# EAGLE design BusBlaster-v2.5 (EAGLE 5.07)
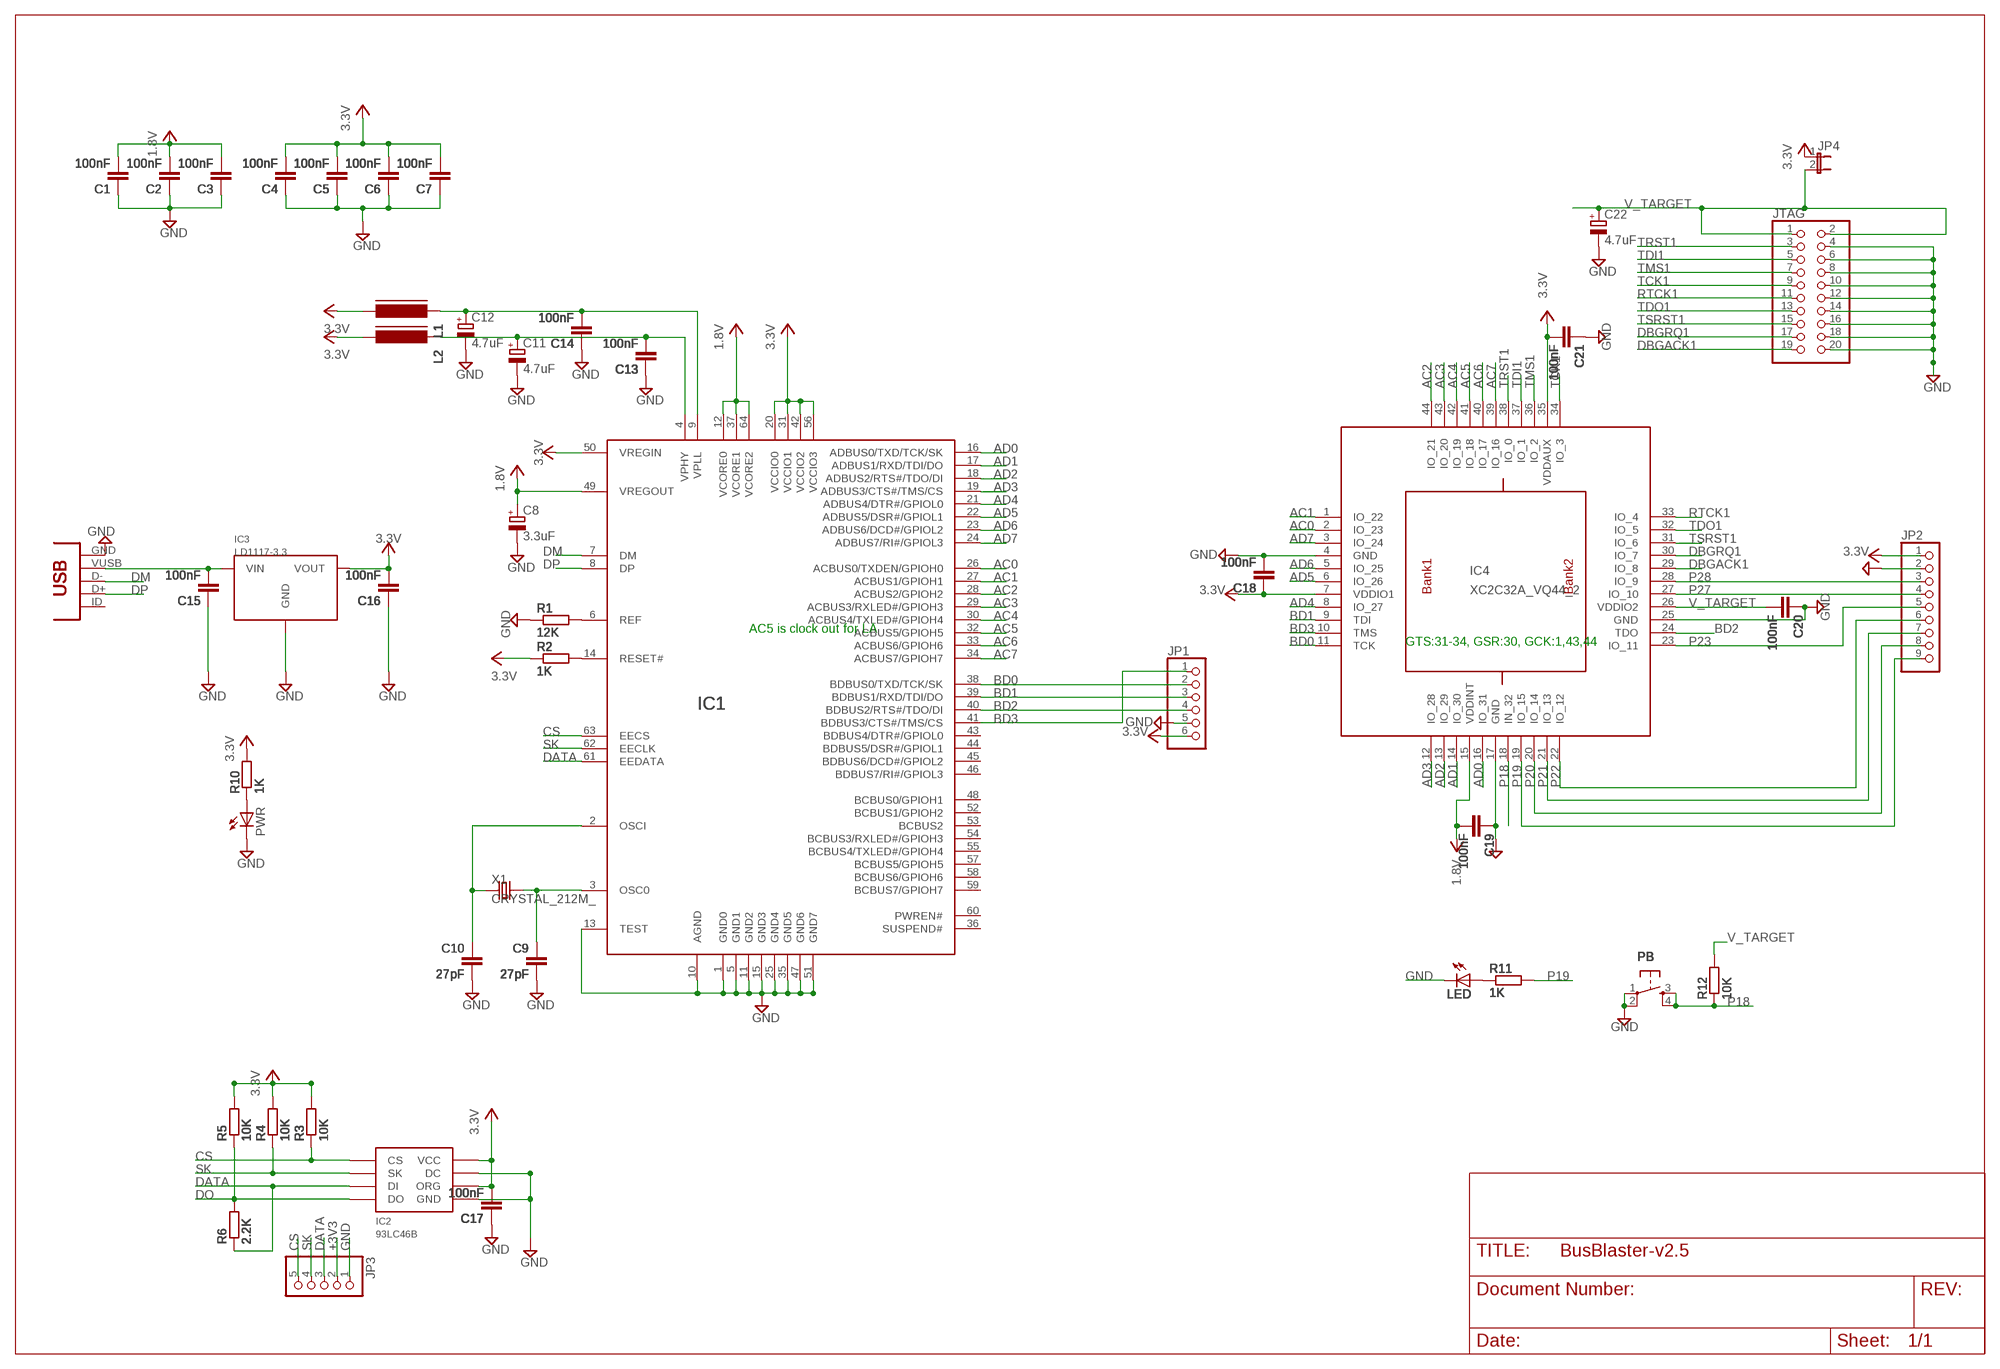
[diagram p0: schematic, sheet 1]

## Parts
C1  100nF  CAPC603  [C603]
C2  100nF  CAPC603  [C603]
C3  100nF  CAPC603  [C603]
C4  100nF  CAPC603  [C603]
C5  100nF  CAPC603  [C603]
C6  100nF  CAPC603  [C603]
C7  100nF  CAPC603  [C603]
C8  3.3uF  CAP_POLSMC_A  [SMC_A]
C9  27pF  CAPC603  [C603]
C10  27pF  CAPC603  [C603]
C11  4.7uF  CAP_POLSMC_A  [SMC_A]
C12  4.7uF  CAP_POLSMC_A  [SMC_A]
C13  100nF  CAPC603  [C603]
C14  100nF  CAPC603  [C603]
C15  100nF  CAPC603  [C603]
C16  100nF  CAPC603  [C603]
C17  100nF  CAPC603  [C603]
C18  100nF  CAPC603  [C603]
C19  100nF  CAPC603  [C603]
C20  100nF  CAPC603  [C603]
C21  100nF  CAPC603  [C603]
C22  4.7uF  CAP_POLSMC_A  [SMC_A]
IC1  FT2232H  [LQFP64]
IC2  93LC46B  93C46  [SOIC8]
IC3  LD1117-3.3  [SOT223]
IC4  XC2C32A_VQ44_2  [VQ44]
JP1  PINHD-1X6  [1X06]
JP2  PINHD-1X9  [1X09]
JP3  PINHD-1X5  [1X05]
JP4  JP1EJP  [1X02]
JTAG  PINHEAD_-_COPY_PINHD-2X10SHROUDED  [PINHEAD_-_COPY_PINSHRD_PTH_2X10]
L1  FERRITE_BEAD603  [FB603]
L2  FERRITE_BEAD603  [FB603]
LED  LED805  [LED-805]
PB  SW-SMD-SMALL  [TACT_SWITCH_SMALL]
PWR  LEDCHIPLED_0805  [CHIPLED_0805]
R1  12K  RESISTORR603  [R603]
R2  1K  RESISTORR603  [R603]
R3  10K  RESISTORR603  [R603]
R4  10K  RESISTORR603  [R603]
R5  10K  RESISTORR603  [R603]
R6  2.2K  RESISTORR603  [R603]
R10  1K  RESISTORR603  [R603]
R11  1K  RESISTORR603  [R603]
R12  10K  RESISTORR603  [R603]
USB  CON-USB-MINI-BUSB1  [CONN_USB_MINI-B]
X1  CRYSTAL_212M_  [4X6]

## Nets
1.8V: C1.2 C2.2 C3.2 C8.+ C19.2 IC1.12(VCORE0) IC1.37(VCORE1) IC1.49(VREGOUT) IC1.64(VCORE2) IC4.15(VDDINT)
+3V3: C4.2 C5.2 C6.2 C7.2 C16.2 C17.2 C18.1 C21.2 IC1.20(VCCIO0) IC1.31(VCCIO1) IC1.42(VCCIO2) IC1.50(VREGIN) IC1.56(VCCIO3) IC2.6(ORG) IC2.8(VCC) IC3.2(VOUT) IC4.7(VDDIO1) IC4.35(VDDAUX) JP1.6 JP2.1 JP3.2 JP4.1 L1.2 L2.2 R2.1 R3.2 R4.2 R5.2 R10.2 ; supply symbol labelled 3.3V
AC0: IC1.26(ACBUS0/TXDEN/GPIOH0) IC4.2(IO_23)
AC1: IC1.27(ACBUS1/GPIOH1) IC4.1(IO_22)
AC2: IC1.28(ACBUS2/GPIOH2) IC4.44(IO_21)
AC3: IC1.29(ACBUS3/RXLED#/GPIOH3) IC4.43(IO_20)
AC4: IC1.30(ACBUS4/TXLED#/GPIOH4) IC4.42(IO_19)
AC5: IC1.32(ACBUS5/GPIOH5) IC4.41(IO_18)
AC6: IC1.33(ACBUS6/GPIOH6) IC4.40(IO_17)
AC7: IC1.34(ACBUS7/GPIOH7) IC4.39(IO_16)
AD0: IC1.16(ADBUS0/TXD/TCK/SK) IC4.16(IO_31)
AD1: IC1.17(ADBUS1/RXD/TDI/DO) IC4.14(IO_30)
AD2: IC1.18(ADBUS2/RTS#/TDO/DI) IC4.13(IO_29)
AD3: IC1.19(ADBUS3/CTS#/TMS/CS) IC4.12(IO_28)
AD4: IC1.21(ADBUS4/DTR#/GPIOL0) IC4.8(IO_27)
AD5: IC1.22(ADBUS5/DSR#/GPIOL1) IC4.6(IO_26)
AD6: IC1.23(ADBUS6/DCD#/GPIOL2) IC4.5(IO_25)
AD7: IC1.24(ADBUS7/RI#/GPIOL3) IC4.3(IO_24)
BD0: IC1.38(BDBUS0/TXD/TCK/SK) IC4.11(TCK) JP1.2
BD1: IC1.39(BDBUS1/RXD/TDI/DO) IC4.9(TDI) JP1.3
BD2: IC1.40(BDBUS2/RTS#/TDO/DI) IC4.24(TDO) JP1.4
BD3: IC1.41(BDBUS3/CTS#/TMS/CS) IC4.10(TMS) JP1.1
CS: IC1.63(EECS) IC2.1(CS) JP3.5 R3.1
DATA: IC1.61(EEDATA) IC2.3(DI) JP3.3 R6.1
DBGACK1: IC4.29(IO_8) JTAG.19
DBGRQ1: IC4.30(IO_7) JTAG.17
DM: IC1.7(DM) USB.D-
DO: IC2.4(DO) R5.1 R6.2
DP: IC1.8(DP) USB.D+
GND: C1.1 C2.1 C3.1 C4.1 C5.1 C6.1 C7.1 C8.- C9.2 C10.2 C11.- C12.- C13.1 C14.1 C15.1 C16.1 C17.1 C18.2 C19.1 C20.1 C21.1 C22.- IC1.1(GND0) IC1.5(GND1) IC1.10(AGND) IC1.11(GND2) IC1.13(TEST) IC1.15(GND3) IC1.25(GND4) IC1.35(GND5) IC1.47(GND6) IC1.51(GND7) IC2.5(GND) IC2.7(DC) IC3.1(GND) IC4.4(GND) IC4.17(GND) IC4.25(GND) JP1.5 JP2.2 JP3.1 JTAG.4 JTAG.6 JTAG.8 JTAG.10 JTAG.12 JTAG.14 JTAG.16 JTAG.18 JTAG.20 LED.C PB.1 PB.2 PWR.C R1.1 USB.GND
N$1: C9.1 IC1.3(OSC0) X1.2(X2)
N$2: C10.1 IC1.2(OSCI) X1.1(X1)
N$3: IC1.14(RESET#) R2.2
N$4: IC1.6(REF) R1.2
N$5: C15.2 IC3.3(VIN) USB.VUSB
N$6: PWR.A R10.1
N$8: LED.A R11.1
P18: IC4.18(IN_32) PB.3 PB.4 R12.1
P19: IC4.19(IO_15) JP2.9 R11.2
P20: IC4.20(IO_14) JP2.8
P21: IC4.21(IO_13) JP2.7
P22: IC4.22(IO_12) JP2.6
P23: IC4.23(IO_11) JP2.5
P27: IC4.27(IO_10) JP2.4
P28: IC4.28(IO_9) JP2.3
RTCK1: IC4.33(IO_4) JTAG.11
SK: IC1.62(EECLK) IC2.2(SK) JP3.4 R4.1
TCK1: IC4.34(IO_3) JTAG.9
TDI1: IC4.37(IO_1) JTAG.5
TDO1: IC4.32(IO_5) JTAG.13
TMS1: IC4.36(IO_2) JTAG.7
TRST1: IC4.38(IO_0) JTAG.3
TSRST1: IC4.31(IO_6) JTAG.15
V_TARGET: C20.2 C22.+ IC4.26(VDDIO2) JP4.2 JTAG.1 JTAG.2 R12.2
VPHY: C11.+ C13.2 IC1.4(VPHY) L2.1
VPLL: C12.+ C14.2 IC1.9(VPLL) L1.1
Unconnected: IC1.36(SUSPEND#) IC1.43(BDBUS4/DTR#/GPIOL0) IC1.44(BDBUS5/DSR#/GPIOL1) IC1.45(BDBUS6/DCD#/GPIOL2) IC1.46(BDBUS7/RI#/GPIOL3) IC1.48(BCBUS0/GPIOH1) IC1.52(BCBUS1/GPIOH2) IC1.53(BCBUS2) IC1.54(BCBUS3/RXLED#/GPIOH3) IC1.55(BCBUS4/TXLED#/GPIOH4) IC1.57(BCBUS5/GPIOH5) IC1.58(BCBUS6/GPIOH6) IC1.59(BCBUS7/GPIOH7) IC1.60(PWREN#) USB.BODY@1(BODY) USB.BODY@2(BODY) USB.BODY@3(BODY) USB.BODY@4(BODY) USB.ID(USBID)

## Notes on the sheet
- AC5 is clock out for LA
- GTS:31-34, GSR:30, GCK:1,43,44

## Library data of the parts
C1-C7 C9 C10 C13-C21 = dp_devices:CAP
C8 C11 C12 C22 = DP-EagleLibrary:CAP_POL
IC1 = dp_devices:FT2232H: DUAL HIGH SPEED USB TO MULTIPURPOSE UART/FIFO IC
IC2 = DP-EagleLibrary:93C46
IC3 = DP-EagleLibrary:LD1117-3.3
IC4 = dp_devices:XC2C32A_VQ44_2: xc2c32a_vq44-ian edit this description Auto generated by make-symbol-device-package-bsdl.ulp Rev. 29 Source: xc2c32a_vq44-ian.bsd
JP1 = pinhead:PINHD-1X6: PIN HEADER
JP2 = pinhead - Copy:PINHD-1X9: PIN HEADER
JP3 = pinhead:PINHD-1X5: PIN HEADER
JP4 = jumper:JP1E: JUMPER
JTAG = LPC1768board:PINHEAD_-_COPY_PINHD-2X10: PIN HEADER
L1 L2 = dp_devices:FERRITE_BEAD
LED = dp_devices:LED
PB = dp_devices:SW-SMD-SMALL
PWR = led:LED: LED OSRAM: - CHIPLED LG R971, LG N971, LY N971, LG Q971, LY Q971, LO R971, LY R971 LH N974, LH R974 LS Q976, LO Q976, LY Q976 LO Q996 - Hyper CHIPLED LW Q18S LB Q993, LB Q99A, LB R99A - SideLED LS A670, LO A670, LY A670, LG A670, LP A670 LB A673, LV A673, LT A673, LW A673 LH A674 LY A675 LS A676, LA A676, LO A676, LY A676, LW A676 LS A679, LY A679, LG A679 - Hyper Micro SIDELED® LS Y876, LA Y876, LO Y876, LY Y876 LT Y87S - SmartLED LW L88C, LW L88S LB L89C, LB L89S, LG L890 LS L89K, LO L89K, LY L89K LS L896, LA L896, LO L896, LY L896 - TOPLED LS T670, LO T670, LY T670, LG T670, LP T670 LSG T670, LSP T670, LSY T670, LOP T670, LYG T670 LG T671, LOG T671, LSG T671 LB T673, LV T673, LT T673, LW T673 LH T674 LS T676, LA T676, LO T676, LY T676, LB T676, LH T676, LSB T676, LW T676 LB T67C, LV T67C, LT T67C, LS T67K, LO T67K, LY T67K, LW E67C LS E67B, LA E67B, LO E67B, LY E67B, LB E67C, LV E67C, LT E67C LW T67C LS T679, LY T679, LG T679 LS T770, LO T770, LY T770, LG T770, LP T770 LB T773, LV T773, LT T773, LW T773 LH T774 LS E675, LA E675, LY E675, LS T675 LS T776, LA T776, LO T776, LY T776, LB T776 LHGB T686 LT T68C, LB T68C - Hyper Mini TOPLED® LB M676 - Mini TOPLED Santana® LG M470 LS M47K, LO M47K, LY M47K Source: http://www.osram.convergy.de LUXEON: - LUMILED® LXK2-PW12-R00, LXK2-PW12-S00, LXK2-PW14-U00, LXK2-PW14-V00 LXK2-PM12-R00, LXK2-PM12-S00, LXK2-PM14-U00 LXK2-PE12-Q00, LXK2-PE12-R00, LXK2-PE12-S00, LXK2-PE14-T00, LXK2-PE14-U00 LXK2-PB12-K00, LXK2-PB12-L00, LXK2-PB12-M00, LXK2-PB14-N00, LXK2-PB14-P00, LXK2-PB14-Q00 LXK2-PR12-L00, LXK2-PR12-M00, LXK2-PR14-Q00, LXK2-PR14-R00 LXK2-PD12-Q00, LXK2-PD12-R00, LXK2-PD12-S00 LXK2-PH12-R00, LXK2-PH12-S00 LXK2-PL12-P00, LXK2-PL12-Q00, LXK2-PL12-R00 Source: www.luxeon.com KINGBRIGHT: KA-3528ASYC Source: www.kingbright.com
R1-R6 R10-R12 = dp_devices:RESISTOR
USB = dp_devices:CON-USB-MINI-B: USB connector
X1 = dp_devices:CRYSTAL_2

## Board
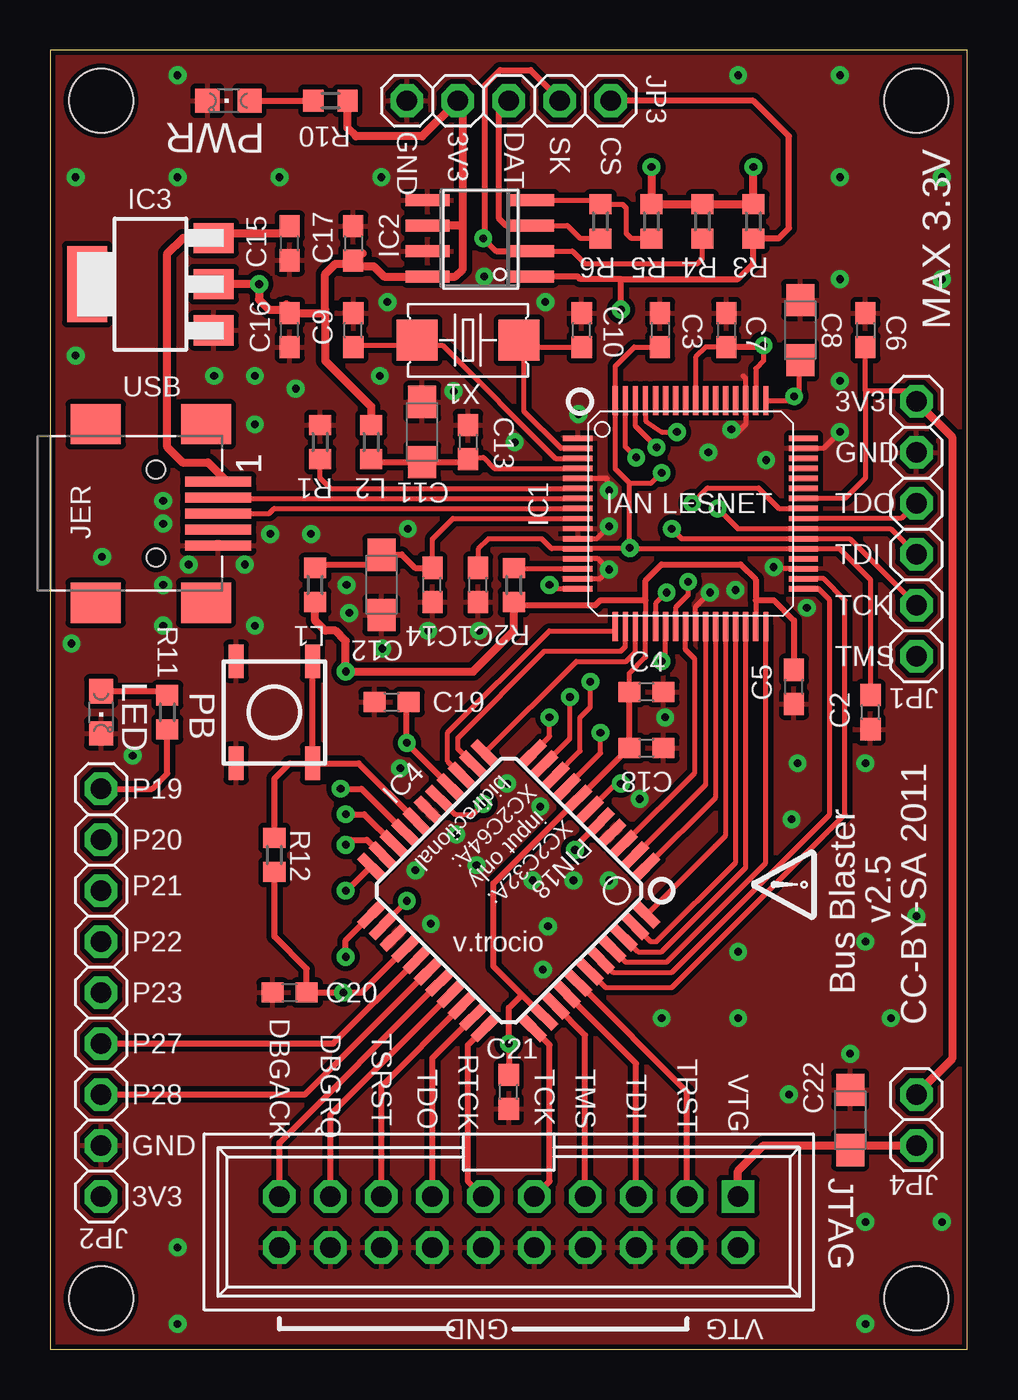
[diagram p1: board, top side]
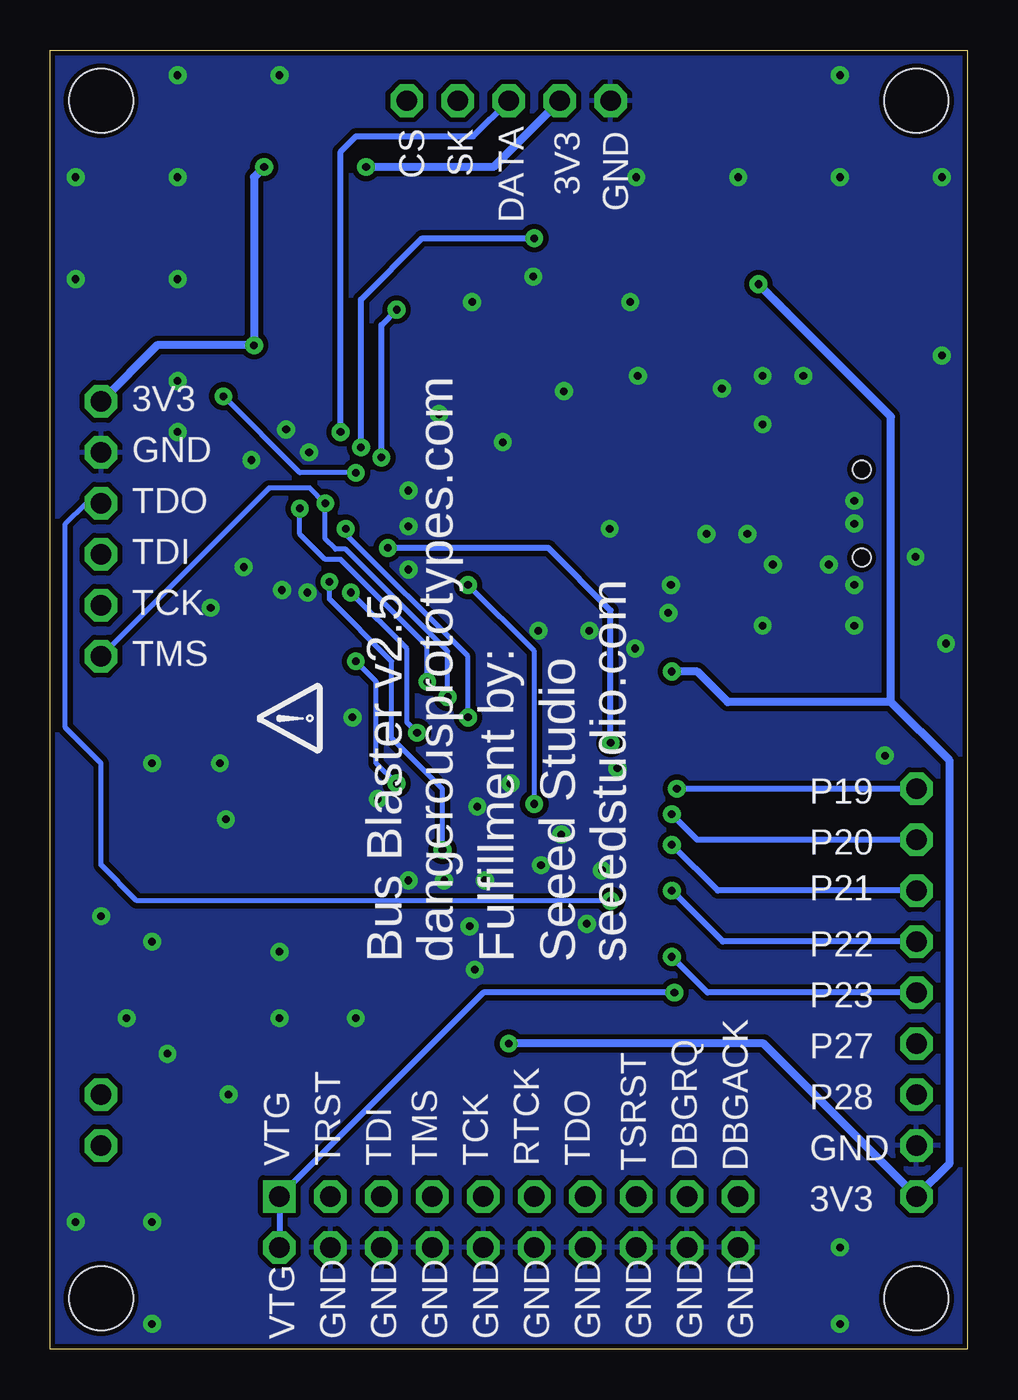
[diagram p2: board, bottom side, seen from below]

Size 45.72 x 64.75 mm. Coordinates in mm from the lower left corner, seen from the top.
Outline: 0,0 45.72,0 45.72,64.75 0,64.75 0,0
Copper layers (1*16): Top 0.035mm / dielectric 1.5mm / Bottom 0.035mm
Design rules "SparkFun *": minimum track width 8mil, minimum drill 13mil, track to track 8mil, track to pad 8mil, pad to pad 8mil, via to via 8mil, smd to smd 8mil, copper to edge 10mil, drill to drill 8mil, minimum pad ring 12mil, minimum via ring 10mil, stop-mask expansion 4mil, vias tented up to drill 25mil, thermal gap 10mil
Holes 3.2 mm at 2.54,2.54 2.54,62.23 43.18,62.23 43.18,2.54

### Footprints (pad centres in the part's own frame; a part is rotated, then mirrored left to right if it is on the bottom)
C603 = smd 1.1 x 1: 1 -0.85,0; 2 0.85,0
SMC_A = smd 1.6 x 1.4: + -1.5,0; - 1.5,0
LQFP64 = smd 1.45 x 0.27: 1 -5.625,3.75; 2 -5.625,3.25; 3 -5.625,2.75; 4 -5.625,2.25; 5 -5.625,1.75; 6 -5.625,1.25; 7 -5.625,0.75; 8 -5.625,0.25; 9 -5.625,-0.25; 10 -5.625,-0.75; 11 -5.625,-1.25; 12 -5.625,-1.75; 13 -5.625,-2.25; 14 -5.625,-2.75; 15 -5.625,-3.25; 16 -5.625,-3.75; 33 5.625,-3.75; 34 5.625,-3.25; 35 5.625,-2.75; 36 5.625,-2.25; 37 5.625,-1.75; 38 5.625,-1.25; 39 5.625,-0.75; 40 5.625,-0.25; 41 5.625,0.25; 42 5.625,0.75; 43 5.625,1.25; 44 5.625,1.75; 45 5.625,2.25; 46 5.625,2.75; 47 5.625,3.25; 48 5.625,3.75 | smd 0.27 x 1.45: 17 -3.75,-5.625; 18 -3.25,-5.625; 19 -2.75,-5.625; 20 -2.25,-5.625; 21 -1.75,-5.625; 22 -1.25,-5.625; 23 -0.75,-5.625; 24 -0.25,-5.625; 25 0.25,-5.625; 26 0.75,-5.625; 27 1.25,-5.625; 28 1.75,-5.625; 29 2.25,-5.625; 30 2.75,-5.625; 31 3.25,-5.625; 32 3.75,-5.625; 49 3.75,5.625; 50 3.25,5.625; 51 2.75,5.625; 52 2.25,5.625; 53 1.75,5.625; 54 1.25,5.625; 55 0.75,5.625; 56 0.25,5.625; 57 -0.25,5.625; 58 -0.75,5.625; 59 -1.25,5.625; 60 -1.75,5.625; 61 -2.25,5.625; 62 -2.75,5.625; 63 -3.25,5.625; 64 -3.75,5.625
SOIC8 = smd 0.6 x 2.2: 1 -1.905,-2.6; 2 -0.635,-2.6; 3 0.635,-2.6; 4 1.905,-2.6; 5 1.905,2.6; 6 0.635,2.6; 7 -0.635,2.6; 8 -1.905,2.6
SOT223 = smd 1.5 x 2: 1 -2.3,-3.15; 2 0,-3.15; 3 2.3,-3.15 | smd 3.8 x 2: 4 0,3.15
VQ44 = smd 1.5 x 0.5: 1 -5.7,4; 2 -5.7,3.2; 3 -5.7,2.4; 4 -5.7,1.6; 5 -5.7,0.8; 6 -5.7,0; 7 -5.7,-0.8; 8 -5.7,-1.6; 9 -5.7,-2.4; 10 -5.7,-3.2; 11 -5.7,-4; 23 5.7,-4; 24 5.7,-3.2; 25 5.7,-2.4; 26 5.7,-1.6; 27 5.7,-0.8; 28 5.7,0; 29 5.7,0.8; 30 5.7,1.6; 31 5.7,2.4; 32 5.7,3.2; 33 5.7,4 | smd 0.5 x 1.5: 12 -4,-5.7; 13 -3.2,-5.7; 14 -2.4,-5.7; 15 -1.6,-5.7; 16 -0.8,-5.7; 17 0,-5.7; 18 0.8,-5.7; 19 1.6,-5.7; 20 2.4,-5.7; 21 3.2,-5.7; 22 4,-5.7; 34 4,5.7; 35 3.2,5.7; 36 2.4,5.7; 37 1.6,5.7; 38 0.8,5.7; 39 0,5.7; 40 -0.8,5.7; 41 -1.6,5.7; 42 -2.4,5.7; 43 -3.2,5.7; 44 -4,5.7
1X06 = drill 1.016 octagon: 1 -6.35,0; 2 -3.81,0; 3 -1.27,0; 4 1.27,0; 5 3.81,0; 6 6.35,0
1X09 = drill 1.016 octagon: 1 -10.16,0; 2 -7.62,0; 3 -5.08,0; 4 -2.54,0; 5 0,0; 6 2.54,0; 7 5.08,0; 8 7.62,0; 9 10.16,0
1X05 = drill 1.016 octagon: 1 -5.08,0; 2 -2.54,0; 3 0,0; 4 2.54,0; 5 5.08,0
1X02 = drill 1.016 octagon: 1 -1.27,0; 2 1.27,0
PINHEAD_-_COPY_PINSHRD_PTH_2X10 = drill 1.016 square: 1 -11.43,-1.27 | drill 1.016 octagon: 2 -11.43,1.27; 3 -8.89,-1.27; 4 -8.89,1.27; 5 -6.35,-1.27; 6 -6.35,1.27; 7 -3.81,-1.27; 8 -3.81,1.27; 9 -1.27,-1.27; 10 -1.27,1.27; 11 1.27,-1.27; 12 1.27,1.27; 13 3.81,-1.27; 14 3.81,1.27; 15 6.35,-1.27; 16 6.35,1.27; 17 8.89,-1.27; 18 8.89,1.27; 19 11.43,-1.27; 20 11.43,1.27
FB603 = smd 1 x 1.1: 1 -0.85,0; 2 0.85,0
LED-805 = smd 1.2 x 1.2: A 0,-1.05; C 0,1.05
TACT_SWITCH_SMALL = smd 1.651 x 0.762: 1 -2.54,1.905; 2 2.54,1.905; 3 -2.54,-1.905; 4 2.54,-1.905
CHIPLED_0805 = smd 1.2 x 1.2: A 0,-1.05; C 0,1.05
R603 = smd 1 x 1.1: 1 -0.85,0; 2 0.85,0
CONN_USB_MINI-B = smd 2 x 2.5: BODY@1 -4.45,2.5; BODY@2 4.45,2.5; BODY@3 4.45,-3; BODY@4 -4.45,-3 | smd 0.5 x 3.3: D+ 0,3.1; D- -0.8,3.1; GND 1.6,3.1; ID 0.8,3.1; VUSB -1.6,3.1 | hole 0.9: -2.2,0; 2.2,0
4X6@1 = smd 2.032 x 2.032: 1 -2.54,0; 2 2.54,0

### Placement (x,y rotation side)
C1  21.34,38.1 90 top
C2  40.89,31.75 90 top
C3  30.4,50.8 270 top
C4  29.72,32.76 180 top
C5  37.08,33.02 90 top
C6  40.64,50.8 270 top
C7  33.7,50.8 270 top
C8  37.38,50.8 90 top
C9  15.11,50.8 90 top
C10  26.5,50.8 90 top
C11  18.54,45.72 90 top
C12  16.51,38.1 270 top
C13  20.83,45.21 270 top
C14  19.05,38.1 90 top
C15  11.94,55.12 90 top
C16  11.94,50.8 90 top
C17  15.11,55.12 270 top
C18  29.72,29.97 0 top
C19  17.02,32.26 0 top
C20  11.94,17.78 0 top
C21  22.86,12.83 90 top
C22  39.88,11.43 90 top
IC1  31.92,41.66 0 top
IC2  21.42,55.37 90 top
IC3  5,53.09 90 top
IC4  22.86,22.86 225 top
JP1  43.18,40.89 90 top
JP2  2.54,17.78 90 top
JP3  22.86,62.23 0 top
JP4  43.18,11.43 270 top
JTAG  22.86,6.35 180 top
L1  13.21,38.1 270 top
L2  16,45.21 90 top
LED  2.54,31.75 180 top
PB  11.18,31.75 90 top
PWR  8.89,62.23 90 top
R1  13.46,45.21 270 top
R2  23.11,38.1 90 top
R3  35.05,56.21 90 top
R4  32.51,56.21 90 top
R5  29.97,56.21 90 top
R6  27.43,56.21 90 top
R10  13.97,62.23 0 top
R11  5.84,31.75 270 top
R12  11.18,24.64 270 top
U$1  [DP_LOGO]  37.59,23.16 90 top
U$3  [DP_LOGO]  32.77,31.45 90 bottom
USB  5.27,41.66 270 top
X1  CRYSTAL_212M_  [4X6@1]  20.83,50.29 180 top

### Tracks (layer width: path | path; a pad name or v marks a point on that pad's centre or on a via)
1.8V  (via drill 0.38)
  Top 0.254: 28.88,43.18 28.17,43.88 IC1.64 28.17,49 29.12,49.95 C3.2 | 28.88,39.91 28.88,43.18 | C8.+ 37.34,49.25 37.34,47.75 v37.08,47.5 36.84,47.26 35.7,47.26 IC1.49 | C1.2 21.34,39.88 21.84,40.39 24.51,40.39 24.99,39.91 IC1.12 28.93,39.91 | C2.2 40.89,38.35 39.34,39.91 IC1.37 28.93,39.91 | v28.89,39.94 28.93,39.91 | 28.88,43.18 29.97,43.18 v30.48,43.69
  Top 0.305: C19.2 17.76,32 17.76,30.23 | 17.76,30.23 IC4.15 | 17.76,30.23 v17.78,30.23 | 28.88,39.91 28.88,39.92 v28.89,39.94
  Bottom 0.254: v37.08,47.5 33.27,43.69 v30.48,43.69
  Bottom 0.305: v17.78,30.23 17.78,36.83 20.89,39.94 v28.89,39.94
+3V3  (via drill 0.38)
  Top 0.254: C7.2 32.68,49.95 32.17,49.45 IC1.56 | C4.2 28.87,33.69 29.67,34.5 IC1.20 29.67,37.34 | R2.1 23.02,37.34 | v35.56,50.04 35.56,49.28 35.17,48.89 IC1.50 | IC1.42 39.61,42.41 40.64,43.43 40.64,47.75 | 35.17,37.34 IC1.31 | 40.64,47.75 C6.2 | JP1.6 42.67,47.75 40.64,47.75
  Top 0.305: C4.2 C18.1 28.84,29.97 IC4.7 22.1,23.23 22.1,19.1 23.52,17.68 | C5.2 37.08,36.33 36.07,37.34 35.17,37.34 35.17,38.36 34.42,39.12 30.48,39.12 29.67,38.31 29.67,37.34 27.43,37.34 27.18,37.08 22.86,37.08 | 23.52,17.68 IC4.35 | C7.2 35.47,49.95 v35.56,50.04 | C21.2 v22.86,15.24 22.86,17.02 23.52,17.68 | 23.11,37.34 22.86,37.08 | 23.11,37.34 23.11,37.59 | 23.02,37.34 23.02,36.99 | 23.02,36.99 22.86,37.08 | 23.11,37.34 R2.1 23.11,37.08 23.02,36.99
  Top 0.406: C17.2 15.58,54.61 | C17.2 14.95,53.98 16.13,53.98 16.64,53.47 IC2.8 20.19,53.47 20.57,53.85 20.57,56.01 | 8.66,53.06 IC3.2 v10.41,53.09 10.41,52.32 10.92,51.82 12.03,51.82 | 12.03,51.82 11.78,52.07 | L2.2 16,46.99 13.72,49.28 13.72,51.82 | 13.72,51.82 13.72,53.59 14.22,54.1 15.2,54.1 C17.2 | 13.72,51.82 13.71,51.65 C16.2 12.03,51.82 | 20.57,56.01 IC2.6 | v29.97,58.93 R5.2 R4.2 R3.2 v35.05,58.93 | 20.57,56.01 20.57,61.98 JP3.2 18.54,60.45 15.24,60.45 14.82,60.87 R10.2 | JP4.1 44.96,14.48 44.96,45.47 JP1.6 | R2.1 23.11,35.81 21.08,33.78 v14.73,33.78 14.73,35.31 14.22,35.81 13.72,35.81 13.21,36.32 L1.2
  Bottom 0.406: v35.05,58.93 35.56,58.42 v35.56,50.04 40.39,50.04 JP1.6 | v29.97,58.93 23.62,58.93 JP3.2 | 3.81,32.26 0.89,29.34 0.89,9.27 JP2.1 10.16,15.24 v22.86,15.24 | 3.81,32.26 3.81,46.48 v10.41,53.09 | 3.81,32.26 11.94,32.26 13.46,33.78 v14.73,33.78
AC0
  Top 0.254: IC4.2 32.67,28.15 IC1.26
AC1
  Top 0.254: IC4.1 33.17,27.52 IC1.27
AC2
  Top 0.254: IC4.44 33.67,25.61 IC1.28
AC3
  Top 0.254: IC4.43 29.93,20.32 30.23,20.32 34.17,24.27 IC1.29
AC4
  Top 0.254: IC4.42 29.3,19.81 30.48,19.81 34.67,24.01 IC1.30
AC5
  Top 0.254: IC4.41 28.68,19.3 30.73,19.3 35.67,24.24 IC1.32
AC6
  Top 0.254: IC4.40 28.05,18.8 30.99,18.8 38.86,26.67 38.86,37.34 38.29,37.91 IC1.33
AC7
  Top 0.254: IC4.39 27.69,18.03 30.99,18.03 39.62,26.67 39.62,37.34 38.56,38.41 IC1.34
AD0  (via drill 0.38)
  Top 0.254: v24.89,38.1 25.09,37.91 IC1.16 | v21.59,27.18 21.08,26.67 20.18,26.67 IC4.16
  Bottom 0.254: v24.89,38.1 21.59,34.8 v21.59,27.18
AD1
  Top 0.254: IC4.14 19.81,29.3 19.81,30.73 24.88,35.8 28.15,35.8 IC1.17
AD2
  Top 0.254: IC4.13 20.32,29.93 20.32,30.48 24.64,34.8 28.45,34.8 28.67,35.02 IC1.18
AD3
  Top 0.254: IC4.12 26.23,34.29 28.7,34.29 29.17,34.76 IC1.19
AD4  (via drill 0.38)
  Top 0.254: IC4.8 25.76,28.05 27.43,29.72 v27.43,30.73 | IC1.21 30.17,37.16 v30.73,37.72
  Bottom 0.254: v30.73,37.72 27.94,34.92 27.94,31.24 v27.43,30.73
AD5  (via drill 0.38)
  Top 0.254: v28.45,28.19 28.19,28.19 IC4.6 | IC1.22 30.67,34.48 v30.48,34.29
  Bottom 0.254: v28.45,28.19 29.46,29.21 29.46,33.27 v30.48,34.29
AD6  (via drill 0.38)
  Top 0.254: IC1.23 31.17,36.97 31.8,37.59 v31.8,38.25
  Top 0.305: IC4.5 26.16,25.03 v26.16,24.89
  Bottom 0.254: v31.8,38.25 31.8,37.39 28.7,34.29 28.7,30.48 26.16,27.94 v26.16,24.89
AD7
  Top 0.254: IC4.3 32.13,28.74 32.13,34.42 31.67,34.87 IC1.24
BD0  (via drill 0.38)
  Top 0.254: IC4.11 24.89,30.55 v24.89,31.5 | v30.99,40.89 31.48,40.41 IC1.38 39.86,40.41 JP1.2
  Bottom 0.254: v24.89,31.5 24.89,34.54 30.99,40.64 v30.99,40.89
BD1  (via drill 0.38)
  Top 0.254: JP1.3 41.9,40.91 IC1.39 34.28,40.91 v33.27,41.91 | v26.92,33.27 26.92,32 26.42,31.5 26.42,29.81 IC4.9
  Bottom 0.254: v33.27,41.91 33.27,40.64 32,39.37 31.24,39.37 26.92,35.05 v26.92,33.27
BD2  (via drill 0.38 pad 0.38)
  Top 0.254: JP1.4 42.42,41.41 IC1.40 | IC4.24 16.57,21.14 v17.78,22.35
  Bottom 0.254: v17.78,22.35 41.4,22.35 43.18,24.13 43.18,29.21 44.96,30.99 44.96,41.15 43.94,42.16 JP1.4
BD3  (via drill 0.38)
  Top 0.254: IC4.10 25.91,30.43 v25.91,32.51 | v32,42.16 32.77,42.93 35.31,42.93 36.33,41.91 IC1.41
  Bottom 0.254: v25.91,32.51 25.91,34.8 30.99,39.88 31.5,39.88 32,40.39 v32,42.16 32.77,42.93 34.8,42.93 JP1.1
CS  (via drill 0.38)
  Top 0.254: v29.21,44.45 28.67,44.99 IC1.63
  Top 0.305: IC2.1 26.29,53.47 26.42,53.34 28.45,53.34 | 28.45,53.34 34.29,53.34 35.05,54.1 R3.1 35.06,55.37 36.32,55.37 36.83,55.88 36.83,60.45 35.05,62.23 JP3.5 | v28.45,51.82 28.45,53.34
  Bottom 0.305: v29.21,44.45 29.21,51.05 v28.45,51.82
DATA  (via drill 0.38)
  Top 0.254: IC2.3 25.78,56.01 26.42,55.37 27.42,55.37 R6.1 | v31.24,45.72 30.48,45.72 29.67,46.27 IC1.61
  Top 0.305: JP3.3 22.35,61.72 22.35,56.39 22.73,56.01 IC2.3
  Bottom 0.305: v31.24,45.72 31.24,59.69 30.48,60.45 24.64,60.45 JP3.3
DBGACK1
  Top 0.305: JTAG.19 11.43,10.3 IC4.29
DBGRQ1
  Top 0.305: JTAG.17 13.97,11.71 IC4.30
DM
  Top 0.254: 8.89,42.41 8.24,42.41 | USB.D- 8.84,42.46 8.89,42.41 | 8.89,42.41 IC1.7
DO
  Top 0.254: IC2.4 27.05,57.28 27.18,57.4 27.09,57.4 R6.2 28.53,57.06 28.7,56.9 28.7,55.63 28.96,55.37 29.96,55.37 R5.1
DP
  Top 0.254: USB.D+ 10.92,41.66 11.17,41.91 IC1.8
GND  (via drill 0.38)
  Top 0.254: IC1.5 27.76,43.41 v27.86,42.8 | 34.54,48.51 34.67,48.38 IC1.51 34.67,46.1 34.29,45.72 34.08,45.72 v33.96,45.85 | IC1.35 36.15,38.91 v36.07,38.99 | IC1.15 27.4,38.41 v27.86,38.86 27.32,39.41 IC1.13 | IC1.11 27.25,40.41 v27.86,41.02 | IC1.25 32.17,37 v32.89,37.72 | IC1.47 38.56,44.91 v39.37,45.72
  other vias: 20.11,47.75 10.97,40.64 9.7,39.12 37.26,29.21 29.38,27.43 30.65,31.5 5.63,41.15 14.78,38.1 14.91,36.7 18.84,35.81 21.38,35.81 16.56,34.92 24.05,23.37 27.86,23.37 18.21,23.88 20.24,25.65 22.78,28.19 17.45,28.96 26.08,23.37 34.29,16.51 30.48,16.51 34.29,19.81 39.37,63.5 39.37,58.42 39.37,53.34 44.45,53.34 44.45,58.42 34.29,63.5 6.35,63.5 1.27,58.42 6.35,58.42 11.43,58.42 16.51,58.42 1.27,49.53 6.35,1.27 6.35,5.08 40.64,1.27 41.91,16.51 40.64,20.32 36.83,12.7 18.97,21.21 24.81,21.08 24.56,18.92 24.43,27.05 21.26,24.13 39.37,48.26 35.69,44.32 37.72,36.96 36.96,26.42 34.16,37.85 32.81,44.7 26.34,46.61 16.43,48.51 16.81,52.2 24.68,52.2 21.64,53.47 23.16,45.21 12.24,47.88 8.18,48.51 10.21,46.1 5.63,42.29 2.59,39.5 10.21,36.07 1.06,35.18 10.21,48.51 13,40.64 17.83,40.89 5.63,38.1 6.91,39.12 43.18,21.59 40.64,29.21 44.45,6.35 40.64,6.35 39.88,14.73 5.63,36.07 4.11,29.59
  pour Bottom (isolate 0.254): 0,64.75 0,0 45.72,0 45.72,64.75
  pour Top (isolate 0.254): 0,64.75 0,0 45.72,0 45.72,64.75
N$1
  Top 0.254: C9.1 15.37,50.16 15.24,50.04 18.03,50.04 X1.2 | X1.2 18.29,50.55 18.54,50.29 | X1.2 18.54,50.04 19.56,50.04 25.19,44.41 IC1.3
N$2
  Top 0.254: 23.62,49.95 23.62,46.74 25.45,44.91 IC1.2 | 23.62,50.29 23.88,50.04 23.62,49.95 | 23.62,49.95 23.71,49.95 | 23.71,49.95 C10.1 | 23.71,49.95 X1.1
N$3
  Top 0.254: IC1.14 23.15,38.91 R2.2
N$4
  Top 0.254: R1.2 13.46,43.43 13.99,42.91 IC1.6
N$5
  Top 0.406: C15.2 12.19,55.63 8.9,55.63 IC3.3 6.62,55.39 5.84,54.61 5.84,44.96 6.6,44.2 7.87,44.2 8.69,43.38 USB.VUSB
N$6
  Top 0.305: PWR.A R10.1
N$8
  Top 0.305: LED.A 5.64,32.8 R11.1
P18
  Top 0.305: PB.3 PB.4 | PB.3 15.38,29.21 IC4.18 | R12.1 11.18,28.45 11.94,29.21 PB.3
P19  (via drill 0.38)
  Top 0.305: IC4.19 15.52,27.94 v14.48,27.94 | R11.2 5.84,28.7 5.08,27.94 JP2.9
  Bottom 0.305: JP2.9 v14.48,27.94
P20  (via drill 0.38)
  Top 0.305: IC4.20 15.66,26.67 v14.73,26.67
  Bottom 0.305: v14.73,26.67 13.46,25.4 JP2.8
P21  (via drill 0.38)
  Top 0.305: IC4.21 15.79,25.4 14.99,25.4 v14.73,25.15
  Bottom 0.305: v14.73,25.15 12.45,22.86 JP2.7
P22  (via drill 0.38)
  Top 0.305: IC4.22 14.8,22.86 v14.73,22.86
  Bottom 0.305: v14.73,22.86 12.19,20.32 JP2.6
P23  (via drill 0.38)
  Top 0.305: IC4.23 14.73,20.39 v14.73,19.56
  Bottom 0.305: v14.73,19.56 12.95,17.78 JP2.5
P27
  Top 0.305: JP2.4 14.11,15.24 IC4.27
P28
  Top 0.305: JP2.3 12.7,12.7 IC4.28
RTCK1
  Top 0.305: IC4.33 20.83,15.17 20.83,8.38 JTAG.11
SK  (via drill 0.38)
  Top 0.254: IC2.2 26.04,54.74 26.67,54.1 32.26,54.1 32.51,54.36 R4.1 | v30.23,44.96 29.17,46.01 IC1.62
  Top 0.305: JP3.4 25.4,62.31 23.95,63.75 22.43,63.75 21.67,62.99 21.67,55.45 v21.59,55.37 22.23,54.74 IC2.2
  Bottom 0.305: v30.23,44.96 30.23,52.32 27.18,55.37 v21.59,55.37
TCK1
  Top 0.305: IC4.34 24.89,15.17 24.89,8.38 JTAG.9
TDI1
  Top 0.305: JTAG.5 29.21,14.25 IC4.37
TDO1
  Top 0.305: JTAG.13 19.05,14.52 IC4.32
TMS1
  Top 0.305: JTAG.7 26.67,15.66 IC4.36
TRST1
  Top 0.305: JTAG.3 31.75,12.84 IC4.38
TSRST1
  Top 0.305: JTAG.15 16.51,13.12 IC4.31
V_TARGET  (via drill 0.38)
  Top 0.305: IC4.26 15.52,17.78 v14.61,17.78 C20.2 12.79,18.96 11.18,20.57 R12.2
  Top 0.406: JTAG.1 34.29,8.89 35.56,10.16 39.37,10.16 | 39.37,10.16 JP4.2 | C22.+ 39.88,10.16 39.37,10.16
  Bottom 0.305: JTAG.2 JTAG.1 24.13,17.78 v14.61,17.78
VPHY
  Top 0.254: C13.2 20.49,44.45 21.59,44.45 22.13,43.91 IC1.4
  Top 0.305: C13.2 20.74,44.36 20.6,44.22 C11.+ 16.23,44.22 15.84,44.36 L2.1
VPLL
  Top 0.254: C14.2 19.05,40.39 20.07,41.41 IC1.9
  Top 0.305: L1.1 13.04,38.95 13.46,39.12 16.03,39.12 C12.+ 16.23,39.62 17.53,39.62 18.2,38.95 C14.2

### Text on the board
tNames: GND | 3V3 | DAT | SK | CS | MAX 3.3V | 3V3 | GND | IAN LESNET | TDO | JER | TDI | TCK | TMS | P19 | P20 | P21 | v2.5 | P22 | v.trocio | Bus Blaster | P23 | DBGACK | DBGRQ | TSRST | CC-BY-SA 2011 | P27 | RTCK | TDO | TCK | TMS | TDI | TRST | VTG | P28 | GND | 3V3 | GND | VTG
bNames: GND | 3V3 | DATA | SK | CS | 3V3 | GND | TDO | TDI | TCK | TMS | P19 | P20 | P21 | P22 | seeedstudio.com | Seeed Studio | Fulfillment by: | dangerousprototypes.com | Bus Blaster v2.5 | P23 | P27 | P28 | GND | DBGACK | DBGRQ | TSRST | TDO | RTCK | TCK | TMS | TDI | TRST | VTG | 3V3 | GND | GND | GND | GND | GND | GND | GND | GND | GND | VTG